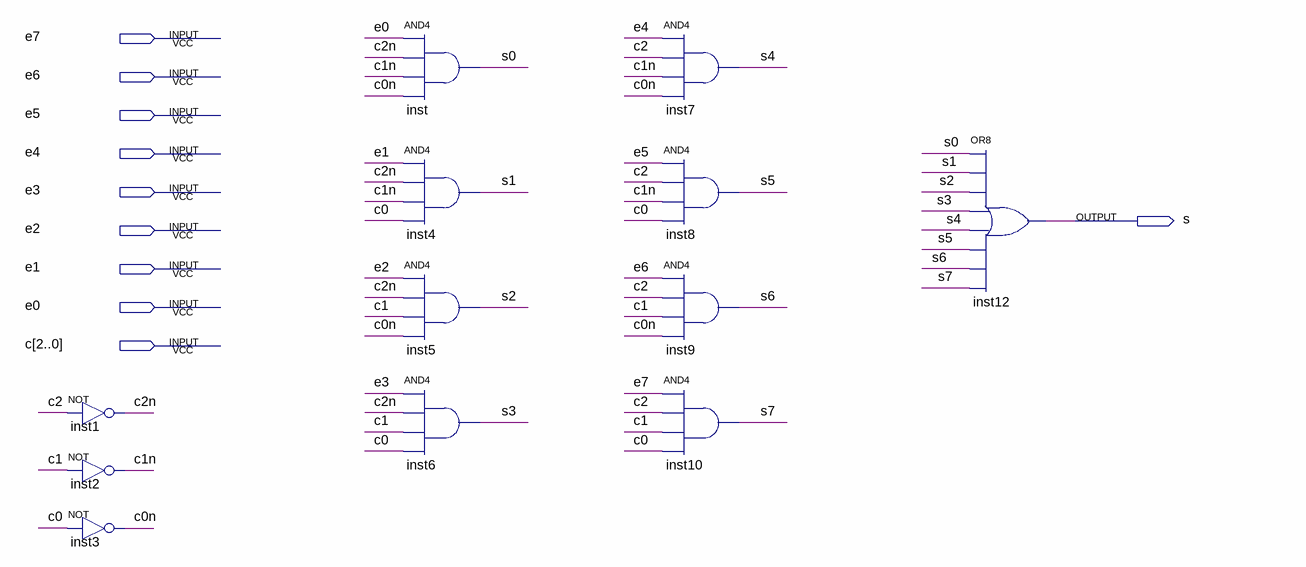
[diagram p0: schematic sheet]
// Quartus schematic abk_mux8x1.bdf as structural Verilog: 12 symbols, 10 pins
module abk_mux8x1 (
  input  e7,
  input  e6,
  input  e5,
  input  e4,
  input  e3,
  input  e2,
  input  e1,
  input  e0,
  input  [2:0] c,
  output s
);

  wire c0n, c1n, c2n, s0, s1, s2, s3, s4, s5, s6, s7;

  not inst1 (c2n, c[2]);
  not inst2 (c1n, c[1]);
  not inst3 (c0n, c[0]);
  and inst (s0, e0, c2n, c1n, c0n);
  and inst4 (s1, e1, c2n, c1n, c[0]);
  and inst5 (s2, e2, c2n, c[1], c0n);
  and inst6 (s3, e3, c2n, c[1], c[0]);
  and inst7 (s4, e4, c[2], c1n, c0n);
  and inst8 (s5, e5, c[2], c1n, c[0]);
  and inst9 (s6, e6, c[2], c[1], c0n);
  and inst10 (s7, e7, c[2], c[1], c[0]);
  or inst12 (s, s0, s1, s2, s3, s4, s5, s6, s7);
endmodule
